# EAGLE design multiconnector (EAGLE 7.7.0)
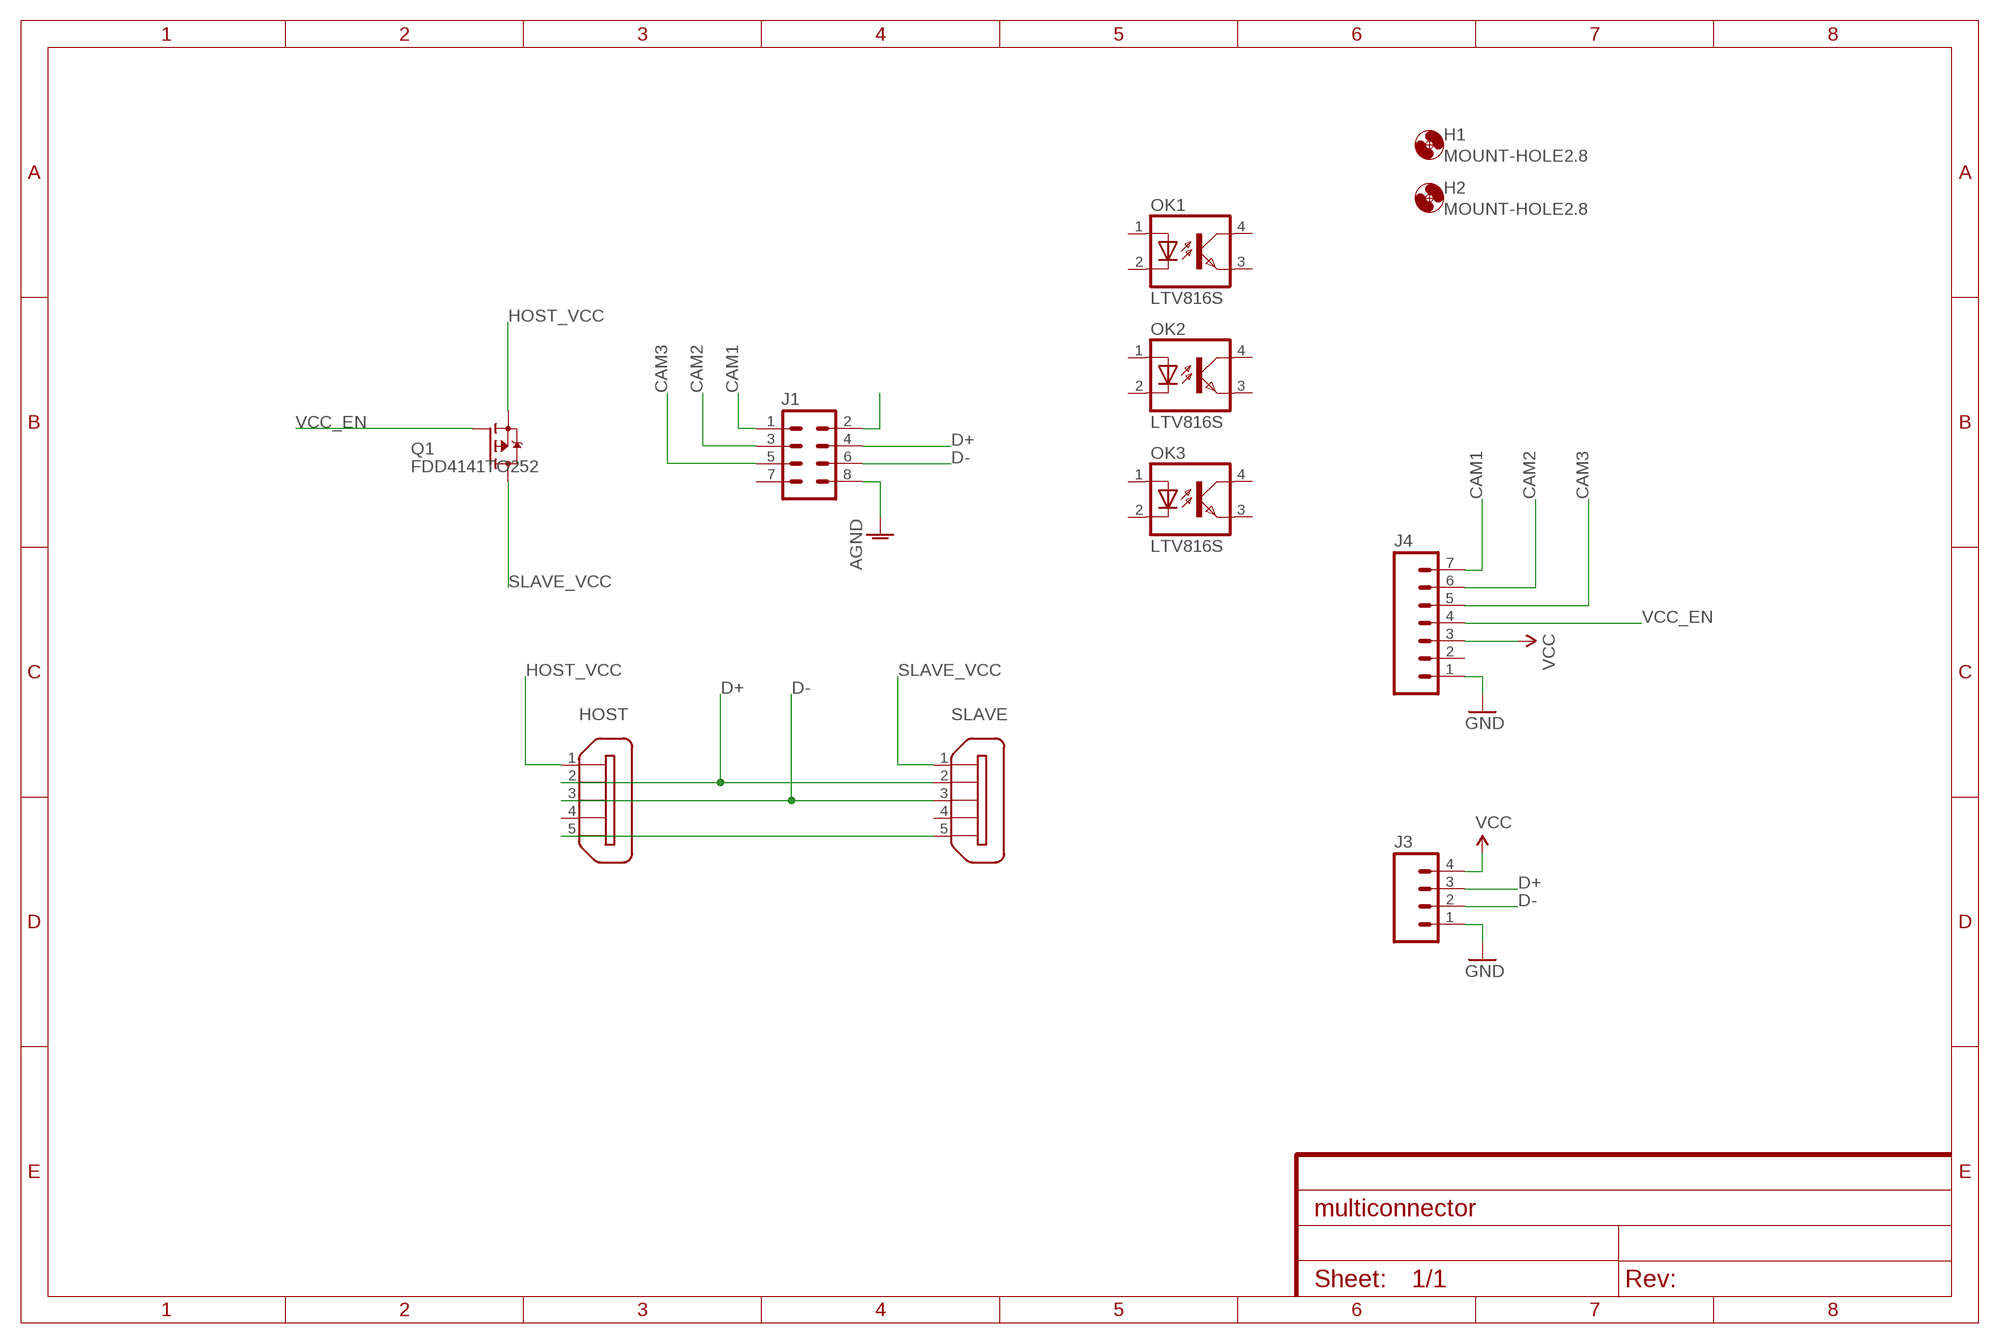
[diagram p0: schematic, sheet 1]

## Parts
H1  MOUNT-HOLE2.8  [2,8]
H2  MOUNT-HOLE2.8  [2,8]
HOST  ZX62D-B-5PA8  [ZX62D-B-5PA8]
J1  M04X2  [2X4]
J3  M04LOCK  [1X04_LOCK]
J4  M07LOCK  [1X07_LOCK]
OK1  LTV816S  [SMD4]
OK2  LTV816S  [SMD4]
OK3  LTV816S  [SMD4]
Q1  FDD4141TO252  [TO252]
SLAVE  ZX62D-B-5PA8  [ZX62D-B-5PA8]

## Nets
AGND: J1.8
CAM1: J1.1
CAM2: J1.3 J4.6
CAM3: J1.5 J4.5
D+: HOST.2 J1.4 J3.3 SLAVE.2
D-: HOST.3 J1.6 J3.2 SLAVE.3
GND: J3.1 J4.1
HOST_VCC: HOST.1 Q1.2(S)
N$1: HOST.5 SLAVE.5
N$2: J1.2
SLAVE_VCC: Q1.3(D) SLAVE.1
VCC: J3.4 J4.3
VCC_EN: J4.4 Q1.1(G)
Unconnected: HOST.4 HOST.S1 HOST.S2 HOST.S3 HOST.S4 J1.7 J4.2 J4.7 OK1.1(A) OK1.2(C) OK1.3(EMIT) OK1.4(COL) OK2.1(A) OK2.2(C) OK2.3(EMIT) OK2.4(COL) OK3.1(A) OK3.2(C) OK3.3(EMIT) OK3.4(COL) SLAVE.4 SLAVE.S1 SLAVE.S2 SLAVE.S3 SLAVE.S4

## Library data of the parts
H1 H2 = holes:MOUNT-HOLE: MOUNTING HOLE with drill center marker
HOST SLAVE = zx62d-b-5pa8-oshpark_10:ZX62D-B-5PA8: Micro USB Type B Connector - Standard, Shell Through Hole Source: http://www.hirose.co.jp/cataloge_hp/ed_ZX_20140804.pdf; MF: Hirose; MPN: ZX62D-B-5PA8; OC_FARNELL: 2300438; OC_NEWARK: 69W0712
J1 = SparkFun-Connectors:M04X2: .1" header, two rows of four.
J3 = SparkFun-Connectors:M04: Header 4 Standard 4-pin 0.1" header. Use with straight break away headers (SKU : PRT-00116), right angle break away headers (PRT-00553), swiss pins (PRT-00743), machine pins (PRT-00117), and female headers (PRT-00115). Molex polarized connector foot print use with SKU : PRT-08231 with associated crimp pins and housings. 1MM SMD Version SKU: PRT-10208; PROD_ID: CONN-09696
J4 = SparkFun-Connectors:M07: Header 7 Standard 7-pin 0.1" header. Use with straight break away headers (SKU : PRT-00116), right angle break away headers (PRT-00553), swiss pins (PRT-00743), machine pins (PRT-00117), and female headers (PRT-00115). NOTES ON THE VARIANTS LOCK and LOCK_LONGPADS... This footprint was designed to help hold the alignment of a through-hole component (i.e. 7-pin header) while soldering it into place. You may notice that each hole has been shifted either up or down by 0.005 of an inch from it's more standard position (which is usually a perfectly straight line). This slight alteration caused the pins (the squares in the middle) to touch the edges of the holes. Because they are alternating, it causes a "brace" to hold the header in place. 0.005 has proven to be the perfect amount of "off-center" position when using our standard breakaway headers. Although looks a little odd when you look at the bare footprint, once you have a header in there, the alteration is very hard to notice. Also, if you push a header all the way into place, it is covered up entirely on the bottom side. This idea of altering the position of holes to aid alignment will be further integrated into the Sparkfun Library for other footprints. It can help hold any component with 3 or more connection pins.
OK1-OK3 = optocoupler:LTV816: OPTO COUPLER Source: LITEON, LTV816.pdf; OC_FARNELL: unknown; OC_NEWARK: unknown
Q1 = transistor-fet:FDD4141: P-Channel PowerTrench® MOSFET Source: FDD4141.pdf

## Board
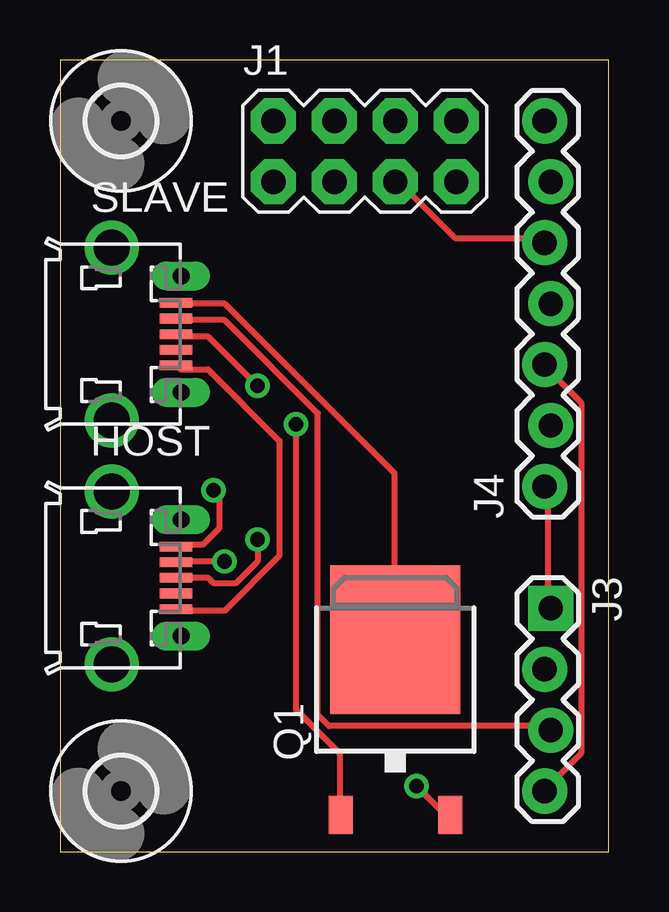
[diagram p1: board, top side]
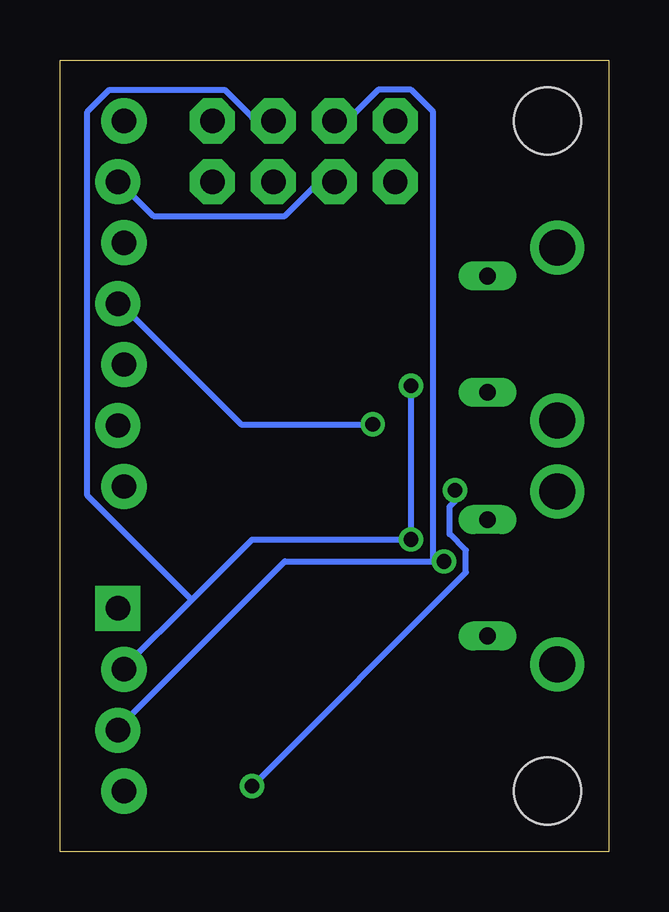
[diagram p2: board, bottom side, seen from below]

Size 22.86 x 33.02 mm. Coordinates in mm from the lower left corner, seen from the top.
Outline: 0,0 22.86,0 22.86,33.02 0,33.02 0,0
Copper layers (1*16): Top 0.035mm / dielectric 1.5mm / Bottom 0.035mm
Design rules "default": minimum track width 10mil, minimum drill 24mil, track to track 8mil, track to pad 8mil, pad to pad 8mil, via to via 8mil, smd to smd 8mil, copper to edge 40mil, drill to drill 8mil, minimum pad ring 10mil, minimum via ring 8mil, stop-mask expansion 4mil, vias tented up to drill 0mil, thermal gap 10mil

### Footprints (pad centres in the part's own frame; a part is rotated, then mirrored left to right if it is on the bottom)
2,8 = hole 2.8: 0,0
ZX62D-B-5PA8 = smd 1.35 x 0.4: 1 4.825,1.3; 2 4.825,0.65; 3 4.825,0; 4 4.825,-0.65; 5 4.825,-1.3 | drill 1.5: S1 2.15,-3.6; S2 2.15,3.6 | drill 0.7 long: S3 5.05,2.425; S4 5.05,-2.425
2X4 = drill 1.016 pad 1.88 octagon: 1 -3.81,-1.27; 2 -3.81,1.27; 3 -1.27,-1.27; 4 -1.27,1.27; 5 1.27,-1.27; 6 1.27,1.27; 7 3.81,-1.27; 8 3.81,1.27
1X04_LOCK = drill 1.016 pad 1.88 square: 1 0,0.127 | drill 1.016 pad 1.88: 2 2.54,-0.127; 3 5.08,0.127; 4 7.62,-0.127
1X07_LOCK = drill 1.016 pad 1.88: 1 0,0.127; 2 2.54,-0.127; 3 5.08,0.127; 4 7.62,-0.127; 5 10.16,0.127; 6 12.7,-0.127; 7 15.24,0.127
SMD4 = smd 1.78 x 1.55: 1 -1.27,-3.5; 2 1.27,-3.5; 3 1.27,3.5; 4 -1.27,3.5
TO252 = smd 1 x 1.6: 1 -2.28,-4.8; 2 2.28,-4.8 | smd 5.4 x 6.2: 3 0,2.5

### Placement (x,y rotation side)
H1  2.54,30.48 0 top
H2  2.54,2.54 0 top
HOST  0,11.43 0 top
J1  12.7,29.21 0 top
J3  20.32,10.16 270 top
J4  20.32,15.24 90 top
OK1  -13.97,-1.27 0 top  (outside the outline)
OK2  -22.86,-1.27 0 top  (outside the outline)
OK3  -31.75,-1.27 0 top  (outside the outline)
Q1  13.97,6.35 0 top
SLAVE  0,21.59 0 top

### Tracks (layer width: path | path; a pad name or v marks a point on that pad's centre or on a via)
CAM2
  Bottom 0.254: J1.3 11.43,27.89 12.12,27.89 13.49,26.52 18.97,26.52 20.34,27.89 J4.6
CAM3
  Top 0.254: J4.5 20.12,25.6 16.46,25.6 14.17,27.89 J1.5
D+  (via drill 0.61)
  Top 0.254: v6.86,12.12 5.03,12.12 HOST.2 | SLAVE.2 5.03,22.17 6.86,22.17 10.74,18.29 10.74,5.71 11.2,5.26 20.34,5.26 J3.3
  Bottom 0.254: 7.32,12.12 13.49,12.12 20.34,5.26 J3.3 | 7.32,12.12 7.32,30.86 8.23,31.77 9.6,31.77 10.74,30.63 11.43,30.63 J1.4 | 7.32,12.12 v6.86,12.12
D-  (via drill 0.61)
  Top 0.254: HOST.3 6.17,11.43 6.4,11.2 7.32,11.2 8.23,12.12 v8.23,13.03 | v8.23,19.43 6.17,21.49 5.03,21.49 SLAVE.3
  Bottom 0.254: 17.37,10.52 20.12,7.77 J3.2 | 17.37,10.52 14.86,13.03 v8.23,13.03 v8.23,19.43 | 17.37,10.52 21.72,14.86 21.72,30.86 20.8,31.77 16,31.77 14.86,30.63 14.17,30.63 J1.6
GND
  Top 0.254: J4.1 20.34,15.09 20.34,10.29 J3.1
HOST_VCC  (via drill 0.61)
  Top 0.254: v6.4,15.09 6.63,14.86 6.63,13.49 5.94,12.8 5.03,12.8 HOST.1 | v14.86,2.74 16.23,1.37 Q1.2
  Bottom 0.254: v6.4,15.09 6.4,14.63 6.63,14.4 6.63,13.26 5.94,12.57 5.94,11.66 v14.86,2.74
N$1
  Top 0.254: HOST.5 5.03,10.06 6.86,10.06 9.14,12.34 9.14,17.14 6.17,20.12 5.03,20.12 SLAVE.5
SLAVE_VCC
  Top 0.254: SLAVE.1 5.03,22.86 6.86,22.86 13.95,15.77 13.95,8.91 Q1.3
VCC
  Top 0.254: J3.4 20.34,2.74 21.72,4.12 21.72,18.75 20.34,20.12 J4.3
VCC_EN  (via drill 0.61)
  Top 0.254: v9.83,17.83 9.83,5.94 11.66,4.12 11.66,1.6 Q1.1
  Bottom 0.254: v9.83,17.83 15.32,17.83 20.34,22.86 J4.4